# Altium schematic sheet Main.SchDoc
size B; SheetNumber: 1; SheetTotal: 1
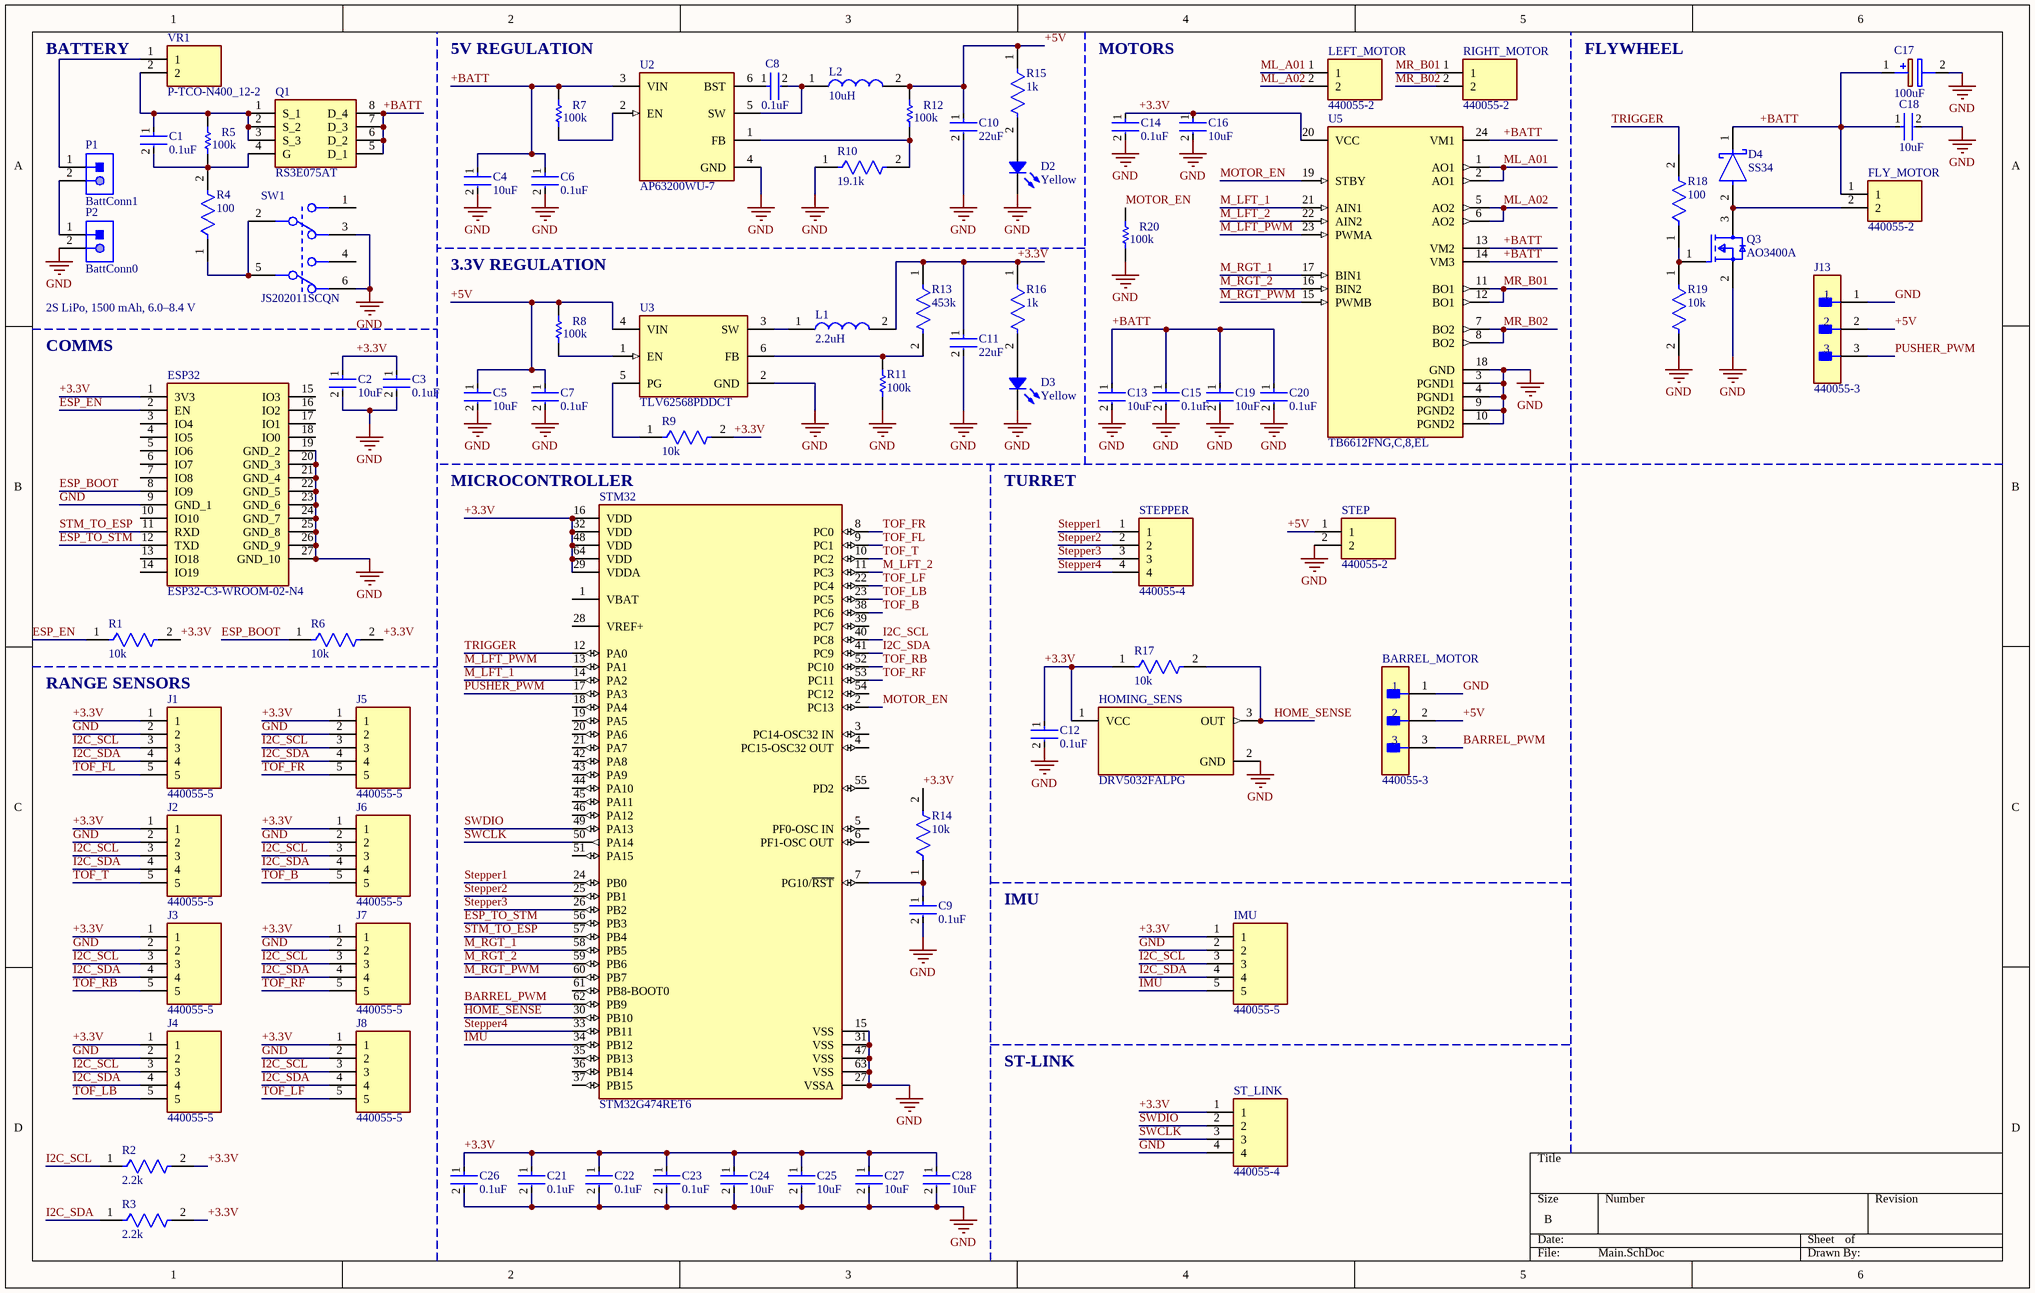
[diagram p0: Main.SchDoc]

## Parts
BARREL_MOTOR  440055-3  [FP-440055-3-MFG]
C1  0.1uF  [FP-C0603C-CF-MFG]
C2  10uF  [FP-GRM188-0_2-IPC_A]
C3  0.1uF  [FP-C0603C-CF-MFG]
C4  10uF  [FP-GRM188-0_2-IPC_A]
C5  10uF  [FP-GRM188-0_2-IPC_A]
C6  0.1uF  [FP-C0603C-CF-MFG]
C7  0.1uF  [FP-C0603C-CF-MFG]
C8  0.1uF  [FP-C0603C-CF-MFG]
C9  0.1uF  [FP-C0603C-CF-MFG]
C10  22uF  [FP-GRM188-0_2-IPC_A]
C11  22uF  [FP-GRM188-0_2-IPC_A]
C12  0.1uF  [FP-C0603C-CF-MFG]
C13  10uF  [FP-GRM188-0_2-IPC_A]
C14  0.1uF  [FP-C0603C-CF-MFG]
C15  0.1uF  [FP-C0603C-CF-MFG]
C16  10uF  [FP-GRM188-0_2-IPC_A]
C17  100uF  [CAPPRD200W55D500H1250]
C18  10uF  [FP-GRM188-0_2-IPC_A]
C19  10uF  [FP-GRM188-0_2-IPC_A]
C20  0.1uF  [FP-C0603C-CF-MFG]
C21  0.1uF  [FP-C0603C-CF-MFG]
C22  0.1uF  [FP-C0603C-CF-MFG]
C23  0.1uF  [FP-C0603C-CF-MFG]
C24  10uF  [FP-GRM188-0_2-IPC_A]
C25  10uF  [FP-GRM188-0_2-IPC_A]
C26  0.1uF  [FP-C0603C-CF-MFG]
C27  10uF  [FP-GRM188-0_2-IPC_A]
C28  10uF  [FP-GRM188-0_2-IPC_A]
D2  Yellow  [LED 1206_3216 YELLOW]
D3  Yellow  [LED 1206_3216 YELLOW]
D4  SS34  [FP-SMC-MFG]
ESP32  ESP32-C3-WROOM-02-N4  [ESP32C3WROOM02N4]
FLY_MOTOR  440055-2  [SHDRRA2W50P0X200_1X2_600X770X525P]
HOMING_SENS  DRV5032FALPG  [FP-LPG0003A-MFG]
IMU  440055-5  [4400555]
J1  440055-5  [4400555]
J2  440055-5  [4400555]
J3  440055-5  [4400555]
J4  440055-5  [4400555]
J5  440055-5  [4400555]
J6  440055-5  [4400555]
J7  440055-5  [4400555]
J8  440055-5  [4400555]
J13  440055-3  [FP-440055-3-MFG]
L1  2.2uH  [VLS2520]
L2  10uH  [VLS3012]
LEFT_MOTOR  440055-2  [SHDRRA2W50P0X200_1X2_600X770X525P]
P1  BattConn1  [JST-S2B-PH-K-S_V]
P2  BattConn0  [JST-S2B-PH-K-S_V]
Q1  RS3E075AT  [SOIC127P600X175-8N]
Q3  AO3400A  [FP-SOT23-MFG]
R1  10k  [FP-AC0603-IPC_A]
R2  2.2k  [FP-RT0603-MFG]
R3  2.2k  [FP-RT0603-MFG]
R4  100  [FP-RT0603-MFG]
R5  100k  [RESC0603(1608)_N]
R6  10k  [FP-AC0603-IPC_A]
R7  100k  [RESC0603(1608)_N]
R8  100k  [RESC0603(1608)_N]
R9  10k  [FP-AC0603-IPC_A]
R10  19.1k  [FP-AC0603-MFG]
R11  100k  [RESC0603(1608)_N]
R12  100k  [RESC0603(1608)_N]
R13  453k  [FP-MCT0603-IPC_B]
R14  10k  [FP-AC0603-IPC_A]
R15  1k  [FP-ERA3A-MFG]
R16  1k  [FP-ERA3A-MFG]
R17  10k  [FP-AC0603-IPC_A]
R18  100  [FP-RT0603-MFG]
R19  10k  [FP-AC0603-IPC_A]
R20  100k  [RESC0603(1608)_N]
RIGHT_MOTOR  440055-2  [SHDRRA2W50P0X200_1X2_600X770X525P]
ST_LINK  440055-4  [SHDRRA4W50P15X200_1X4_1000X770X525P]
STEP  440055-2  [SHDRRA2W50P0X200_1X2_600X770X525P]
STEPPER  440055-4  [SHDRRA4W50P15X200_1X4_1000X770X525P]
STM32  STM32G474RET6  [FP-LQFP64-5W-MFG]
SW1  JS202011SCQN  [FP-JS202011SCQN-MFG]
U2  AP63200WU-7  [FP-TSOT26-MFG]
U3  TLV62568PDDCT  [FP-DDC0006A-MFG]
U5  TB6612FNG,C,8,EL  [FP-SSOP24-P-300-0_65A-IPC_A]
VR1  P-TCO-N400_12-2  [THRMC3216X110N]

## Nets
GND: BARREL_MOTOR.1 C2.2 C3.2 C4.2 C5.2 C6.2 C7.2 C9.2 C10.2 C11.2 C12.2 C13.2 C14.2 C15.2 C16.2 C17.2(-) C18.2 C19.2 C20.2 C21.2 C22.2 C23.2 C24.2 C25.2 C26.2 C27.2 C28.2 D2.2 D3.2 ESP32.9(GND_1) ESP32.19(GND_2) ESP32.20(GND_3) ESP32.21(GND_4) ESP32.22(GND_5) ESP32.23(GND_6) ESP32.24(GND_7) ESP32.25(GND_8) ESP32.26(GND_9) ESP32.27(GND_10) HOMING_SENS.2(GND) IMU.2 J1.2 J2.2 J3.2 J4.2 J5.2 J6.2 J7.2 J8.2 J13.1 P2.2 Q3.2(S) R10.1 R11.1 R19.2 R20.1 ST_LINK.4 STEP.2 STM32.15(VSS) STM32.27(VSSA) STM32.31(VSS) STM32.47(VSS) STM32.63(VSS) SW1.3 SW1.6 U2.4(GND) U3.2(GND) U5.3(PGND1) U5.4(PGND1) U5.9(PGND2) U5.10(PGND2) U5.18(GND)
+3.3V: C2.1 C3.1 C11.1 C12.1 C14.1 C16.1 C21.1 C22.1 C23.1 C24.1 C25.1 C26.1 C27.1 C28.1 ESP32.1(3V3) HOMING_SENS.1(VCC) IMU.1 J1.1 J2.1 J3.1 J4.1 J5.1 J6.1 J7.1 J8.1 L1.2 R1.2 R2.2 R3.2 R6.2 R9.2 R13.1 R14.2 R16.1 R17.1 ST_LINK.1 STM32.16(VDD) STM32.29(VDDA) STM32.32(VDD) STM32.48(VDD) STM32.64(VDD) U5.20(VCC)
+5V: BARREL_MOTOR.2 C5.1 C7.1 C10.1 J13.2 L2.2 R8.2 R12.2 R15.1 STEP.1 U3.4(VIN)
+BATT: C4.1 C6.1 C13.1 C15.1 C17.1(+) C18.1 C19.1 C20.1 D4.1(C) FLY_MOTOR.1 Q1.5(D_1) Q1.6(D_2) Q1.7(D_3) Q1.8(D_4) R7.2 U2.3(VIN) U5.13(VM2) U5.14(VM3) U5.24(VM1)
BARREL_PWM: BARREL_MOTOR.3 STM32.62(PB9)
ESP_BOOT: ESP32.8(IO9) R6.1
ESP_EN: ESP32.2(EN) R1.1
ESP_TO_STM: ESP32.12(TXD) STM32.56(PB3)
HOME_SENSE: HOMING_SENS.3(OUT) R17.2 STM32.30(PB10)
I2C_SCL: IMU.3 J1.3 J2.3 J3.3 J4.3 J5.3 J6.3 J7.3 J8.3 R2.1 STM32.40(PC8)
I2C_SDA: IMU.4 J1.4 J2.4 J3.4 J4.4 J5.4 J6.4 J7.4 J8.4 R3.1 STM32.41(PC9)
IMU: IMU.5 STM32.34(PB12)
M_LFT_1: STM32.14(PA2) U5.21(AIN1)
M_LFT_2: STM32.11(PC3) U5.22(AIN2)
M_LFT_PWM: STM32.13(PA1) U5.23(PWMA)
M_RGT_1: STM32.58(PB5) U5.17(BIN1)
M_RGT_2: STM32.59(PB6) U5.16(BIN2)
M_RGT_PWM: STM32.60(PB7) U5.15(PWMB)
ML_A01: LEFT_MOTOR.1 U5.1(AO1) U5.2(AO1)
ML_A02: LEFT_MOTOR.2 U5.5(AO2) U5.6(AO2)
MOTOR_EN: R20.2 STM32.2(PC13) U5.19(STBY)
MR_B01: RIGHT_MOTOR.1 U5.11(BO1) U5.12(BO1)
MR_B02: RIGHT_MOTOR.2 U5.7(BO2) U5.8(BO2)
PUSHER_PWM: J13.3 STM32.17(PA3)
Stepper1: STEPPER.1 STM32.24(PB0)
Stepper2: STEPPER.2 STM32.25(PB1)
Stepper3: STEPPER.3 STM32.26(PB2)
Stepper4: STEPPER.4 STM32.33(PB11)
STM_TO_ESP: ESP32.11(RXD) STM32.57(PB4)
SWCLK: ST_LINK.3 STM32.50(PA14)
SWDIO: ST_LINK.2 STM32.49(PA13)
TOF_B: J6.5 STM32.38(PC6)
TOF_FL: J1.5 STM32.9(PC1)
TOF_FR: J5.5 STM32.8(PC0)
TOF_LB: J4.5 STM32.23(PC5)
TOF_LF: J8.5 STM32.22(PC4)
TOF_RB: J3.5 STM32.52(PC10)
TOF_RF: J7.5 STM32.53(PC11)
TOF_T: J2.5 STM32.10(PC2)
TRIGGER: R18.2 STM32.12(PA0)
NetC1_1: C1.1 Q1.1(S_1) Q1.2(S_2) Q1.3(S_3) R5.2 VR1.2
NetC1_2: C1.2 Q1.4(G) R4.2 R5.1
NetC8_1: C8.1 U2.6(BST)
NetC8_2: C8.2 L2.1 U2.5(SW)
NetC9_1: C9.1 R14.1 STM32.7(PG10/~{RST})
NetD2_1: D2.1 R15.2
NetD3_1: D3.1 R16.2
NetD4_2: D4.2(A) FLY_MOTOR.2 Q3.3(D)
NetL1_1: L1.1 U3.3(SW)
NetP1_1: P1.1 VR1.1
NetP1_2: P1.2 P2.1
NetQ3_1: Q3.1(G) R18.1 R19.1
NetR4_1: R4.1 SW1.2 SW1.5
NetR7_1: R7.1 U2.2(EN)
NetR8_1: R8.1 U3.1(EN)
NetR9_1: R9.1 U3.5(PG)
NetR10_2: R10.2 R12.1 U2.1(FB)
NetR11_2: R11.2 R13.2 U3.6(FB)

Not connected (* = marked no-connect by the designer): ESP32 3(IO4) 4(IO5) 5(IO6) 6(IO7) 7(IO8) 10(IO10) 13(IO18) 14(IO19) 15(IO3) 16(IO2) 17(IO1) 18(IO0); STM32 1(VBAT) 3(PC14-OSC32_IN) 4(PC15-OSC32_OUT) 5(PF0-OSC_IN) 6(PF1-OSC_OUT) 18(PA4) 19(PA5) 20(PA6) 21(PA7) 28(VREF+) 35(PB13) 36(PB14) 37(PB15) 39(PC7) 42(PA8) 43(PA9) 44(PA10) 45(PA11) 46(PA12) 51(PA15) 54(PC12) 55(PD2) 61(PB8-BOOT0); SW1 1 4

## Notes on the sheet
- BATTERY
- (near R7) 5V REGULATION
- MOTORS
- FLYWHEEL
- Even though the RS3E075AT is efficient, 1.5A still generates some heat.
  Copper Pours: In Altium, use a large Copper Pour (Polygon) for the Drain pins (5, 6, 7, 8). The copper acts as a heatsink to pull heat away from the component.
  Trace Width: Use a Trace Width Calculator. For 1.5A on a standard 1oz copper board, you should aim for at least 35-40 mils (1mm) wide traces for your power path.
- Type @ to refer to a designator
- (near R8) 3.3V REGULATION
- 2S LiPo, 1500 mAh, 6.0–8.4 V
- COMMS
- (near STM32) MICROCONTROLLER
- TURRET
- RANGE SENSORS
- IMU
- ST-LINK

## Library data of the parts
BARREL_MOTOR J13 = CMP-03369-000061-1: CONN HEADER R/A 3POS 2MM; Manufacturer: TE Connectivity; Voltage Rating: 250V; Conn Orientation: Right Angle; Current Rating: 3A; Number Of Contacts: 3; Conn Gender: Male; Height: 5.25mm; Automotive: No; Manufacturer Part Number: 440055-3; Temperature: -25°C to +85°C; Pitch: 2mm; Category: Conn; Device Class L1: Connectors; ComponentLink2Description: Datasheet; Footprint Url: https://www.te.com/commerce/DocumentDelivery/DDEController?Action=showdoc&DocId=Customer+Drawing%7F440055%7FB4%7Fpdf%7FEnglish%7FENG_CD_440055_B4.pdf%7F440055-3; Package: 440055-3; ComponentLink2URL: https://www.te.com/usa-en/product-440055-3.datasheet.pdf; Number Of Rows: 1; Octopart: https://octopart.com/440055-3-te+connectivity-40644627; Mouser Description: Headers & Wire Housings 3 POS HDR R/A 2.0mm; Digikey Description: CONN HEADER R/A 3POS 2MM; Device Class L2: Headers and Wire Housings; Lead Free: Yes; Temperature Range High: +85°C; RoHS: TRUE; Temperature Range Low: -25°C; Contact Material: Tin; Device Class L3: unset
C1 C3 C6-C9 C12 C14 C15 C20-C23 C26 = CMP-2006-03630-2: Manufacturer Part Number: C0603C101F1GACTU; Manufacturer: KEMET; Tolerance: 0.01; Material: Ceramic; Automotive Grade: Grade 1; Capacitance: 100 pF; Voltage Rating: 100 V; Temperature Coefficient: 30ppm/°C; Value: 100 pF; Temperature Characteristic: C0G; Device Class L1: Passive Components; RoHS: TRUE; Height: 0.87mm; Digikey Description: CAP CER 100PF 100V 1% NP0 0603; Device Class L3: Ceramic Capacitors; Temperature: -55°C to +125°C; Package: C0603C-CF; Lead Free: Yes; Category: Cap; Device Class L2: Capacitors; Mouser Description: Multilayer Ceramic Capacitors MLCC - SMD/SMT 100volts 100pF C0G 1%; Temperature Range Low: -55°C; ComponentLink2URL: https://api.kemet.com/component-edge/download/datasheet/C0603C100J5GACAUTO.pdf; Octopart: https://octopart.com/c0603c101f1gactu-kemet-9143865; Automotive: Yes; Temperature Range High: +125°C; ComponentLink2Description: Datasheet
C2 C4 C5 C13 C16 C18 C19 C24 C25 C27 C28 = CMP-2006-02814-2: Chip Multilayer Ceramic Capacitors for General Purpose, 0603, 10uF, X5R, 15%, 20%, 16V; Width: 0.031inch; Case/Package: 0603; Mount: Surface Mount; Capacitance: 10uF; Depth: 0.8mm; REACH SVHC: No SVHC; Lead Free: Lead Free; Tolerance: 20%; Case Code (Imperial): 0603; Voltage Rating: 16V; Height: 0.8mm; Case Code (Metric): 1608; Thickness: 0.031inch; Voltage: 16V; Voltage Rating (DC): 16V; Length: 1.6mm; Max Operating Temperature: 85°C; Dielectric: X5R; Min Operating Temperature: -55°C; Packaging: Tape and Reel; Package Quantity: 4000
C10 C11 = CMP-06035-063651-1: Multilayer Ceramic Capacitor 22uF 20% 16V X5R 0603 Paper T/R
C17 = EEU-FR1C101: Capacitor Polarised; Manufacturer_Name: Panasonic; Datasheet Link: http://industrial.panasonic.com/cdbs/www-data/pdf/RDF0000/ABA0000C1259.pdf; Height: 12.5mm; Manufacturer_Part_Number: EEU-FR1C101; Mouser Part Number: 667-EEU-FR1C101; Mouser Price/Stock: https://www.mouser.co.uk/ProductDetail/Panasonic/EEU-FR1C101?qs=ob%252BdNz2%252BYEhUA1aQKNasqg%3D%3D; Arrow Part Number: EEU-FR1C101; Arrow Price/Stock: https://www.arrow.com/en/products/eeu-fr1c101/panasonic?region=europe
D2 D3 = 25-21UYC/S530-A2/TR8: LED YELLOW CLEAR 2SMD; Manufacturer: Everlight Electronics Co Ltd; Configuration: Standard; Current - Test: 20mA; Lens Color: Colorless; Lens Size: 1.10mm Dia; Lens Style: Round with Domed Top; Millicandela Rating: 45mcd; Viewing Angle: 60°; Voltage - Forward (Vf) (Typ): 2V; Wavelength - Dominant: 589nm; Wavelength - Peak: 591nm; Part Number: 25-21UYC/S530-A2/TR8; Color: Yellow; ComponentLink1Description: Datasheet; ComponentLink1URL: //media.digikey.com/pdf/Data%20Sheets/Everlight%20PDFs/25-21UYC-S530-A2-TR8_V6_11-12-18.pdf; ComponentLink2Description: DigiKey Link; ComponentLink2URL: https://www.digikey.com/en/products/detail/everlight-electronics-co-ltd/25-21UYC-S530-A2-TR8/8535289; Device Package: 1206 (3216 Metric); Height (Max): 1.20mm; LastUpdated: 6/3/2024 8:01:38 PM; Lens Transparency: Clear; Lifecycle Status: Active; Minimum Order: 1; Mounting Type: Surface Mount; Package / Case: 1206 (3216 Metric); Packaging: TapeAndReel; PartId: 2; Part Status: Active; Price: 0.08; Series: -; Size / Dimension: 3.20mm L x 1.60mm W; Supplier 1: DigiKey; Supplier Part Number 1: 1080-1595-1-ND; Supplier Device Package: 2-SMD; Value: Yellow
D4 = CMP-02539-000066-1: DIODE SCHOTTKY 40V 3A DO214AB; Peak Non-Repetitive Surge Current: 100A; Forward Voltage: 500mV; Element Configuration: Single; Max Reverse Current: 500uA; Case/Package: SMC; Radiation Hardening: No; Series: -; Max Surge Current: 100A; RoHS Compliant: Yes; Min Operating Temperature: -55°C; Average Rectified Current: 3A; Max Reverse Leakage Current: 500uA; Package Quantity: 3500; Max Reverse Voltage (DC): 40V; Forward Current: 3A; Packaging: Tape and Reel; Max Operating Temperature: 125°C; Max Repetitive Reverse Voltage (Vrrm): 40V; Number of Pins: 2; Mount: Surface Mount
ESP32 = ESP32-C3-WROOM-02-N4: Integrated Circuit; Manufacturer_Name: Espressif Systems; Datasheet Link: https://www.mouser.ch/datasheet/2/891/Espressif_ESP32_C3_WROOM_02-2006871.pdf; Height: 3.35mm; Manufacturer_Part_Number: ESP32-C3-WROOM-02-N4; Mouser Part Number: 356-ESP32C3WROOM02N4; Mouser Price/Stock: https://www.mouser.co.uk/ProductDetail/Espressif-Systems/ESP32-C3-WROOM-02-N4?qs=stqOd1AaK7%2FqjTZKEOgfUg%3D%3D
FLY_MOTOR LEFT_MOTOR RIGHT_MOTOR STEP = 440055-2: Connector; Manufacturer_Name: TE Connectivity; Datasheet Link: https://www.te.com/commerce/DocumentDelivery/DDEController?Action=srchrtrv&DocNm=1-1773713-2_HPI_QRG_EN&DocType=Data%20Sheet&DocLang=English&PartCntxt=440055-2&DocFormat=pdf; Height: 5.25mm; Manufacturer_Part_Number: 440055-2; Mouser Part Number: 571-440055-2; Mouser Price/Stock: https://www.mouser.co.uk/ProductDetail/TE-Connectivity/440055-2?qs=DE9Qji9blsSmCkgS7fKI6w%3D%3D; Arrow Part Number: 440055-2; Arrow Price/Stock: https://www.arrow.com/en/products/440055-2/te-connectivity?utm_currency=USD&region=nac
HOMING_SENS = CMP-04937-000007-1: LP HALL 32 LPG
IMU J1-J8 = 440055-5: Connector; Manufacturer_Name: TE Connectivity; Datasheet Link: https://www.te.com/commerce/DocumentDelivery/DDEController?Action=srchrtrv&DocNm=1-1773713-2_HPI_QRG_EN&DocType=Data%20Sheet&DocLang=English&PartCntxt=440055-5&DocFormat=pdf; Height: 5.25mm; Manufacturer_Part_Number: 440055-5; Mouser Part Number: 571-440055-5; Mouser Price/Stock: https://www.mouser.co.uk/ProductDetail/TE-Connectivity/440055-5?qs=DE9Qji9blsSCZ1TIZpnBjw%3D%3D; Arrow Part Number: 440055-5; Arrow Price/Stock: https://www.arrow.com/en/products/440055-5/te-connectivity?region=nac
L1 = VLS252010HBX-2R2M-1: Inductor; Manufacturer_Name: TDK; Datasheet Link: https://product.tdk.com/system/files/dam/doc/product/inductor/inductor/smd/catalog/inductor_commercial_power_vls252010hbx-1_en.pdf; Manufacturer_Part_Number: VLS252010HBX-2R2M-1; Mouser Part Number: 810-VLS25201HBX2R2M1; Mouser Price/Stock: https://www.mouser.co.uk/ProductDetail/TDK/VLS252010HBX-2R2M-1?qs=uwKJARvjadMU3dC%2Ft0aiHA%3D%3D; Arrow Part Number: VLS252010HBX-2R2M-1; Arrow Price/Stock: https://www.arrow.com/en/products/vls252010hbx-2r2m-1/tdk?region=europe
L2 = VLS3012CX-100M-1: Inductor; Manufacturer_Name: TDK; Datasheet Link: https://product.tdk.com/system/files/dam/doc/product/inductor/inductor/smd/catalog/inductor_commercial_power_vls3012cx-1_en.pdf; Manufacturer_Part_Number: VLS3012CX-100M-1; Mouser Part Number: 810-VLS3012CX-100M-1; Mouser Price/Stock: https://www.mouser.co.uk/ProductDetail/TDK/VLS3012CX-100M-1?qs=1mbolxNpo8ceNo1aeERl9w%3D%3D; Arrow Part Number: VLS3012CX-100M-1; Arrow Price/Stock: https://www.arrow.com/en/products/vls3012cx-100m-1/tdk?utm_currency=USD&region=europe
P1 P2 = CMP-1755-00004-1: Male Header, Pitch 2 mm, 1 x 2 Position, Height 4.8 mm, Tail Length 3.4 mm, -25 to 85 degC, RoHS, Bulk; Case\Package: Radial; Tolerance: 20%; Capacitance: 10 uF; Voltage Rating (DC): 50 V; Packaging: Bulk; ComponentLink1URL: http://www.jst-mfg.com/product/pdf/eng/ePH.pdf; Radiation Hardening: No; Height: 11 mm; Package Quantity: 200; PackageDescription: Male Header, Pitch 2 mm, 1 x 2 Position, Height 4.8 mm, Tail Length 3.4 mm; PackageReference: S2B-PH-K-S; Diameter: 5 mm; Pins: 2; Mount: Through Hole; Max Operating Temperature: 85 degC; Min Operating Temperature: -40 degC; ComponentLink1Description: Datasheet; DatasheetVersion: Dec-12; Length: 11 mm; Lead Pitch: 2 mm; REACH SVHC: No SVHC; Voltage Rating: 50 V; RoHSCompliant: true
Q1 = RS3E075AT: MOSFET (P-Channel); Manufacturer_Name: ROHM Semiconductor; Datasheet Link: https://fscdn.rohm.com/en/products/databook/datasheet/discrete/transistor/mosfet/rs3e075attb1-e.pdf; Height: 1.75mm; Manufacturer_Part_Number: RS3E075AT; Mouser Part Number: N/A; Mouser Price/Stock: https://www.mouser.co.uk/ProductDetail/ROHM-Semiconductor/RS3E075AT?qs=W0yvOO0ixfG3uBr1%252BCakYg%3D%3D
Q3 = CMP-83955-000006-1: MOSFET N-CH 30V 5.7A SOT23; Input Capacitance: 630pF; Number of Elements: 1; Rds On Max: 26.5mR; Max Power Dissipation: 1.4W; Gate to Source Voltage (Vgs): 12V; Min Operating Temperature: -55°C; Lead Free: Lead Free; Number of Pins: 3; Drain to Source Voltage (Vdss): 30V; Case/Package: SOT-23; Mount: Surface Mount; Continuous Drain Current (ID): 5.7A; Radiation Hardening: No; Packaging: Tape and Reel; Max Operating Temperature: 150°C; Power Dissipation: 1.4W
R1 R6 R9 R14 R17 R19 = CMP-03412-040683-1: RES 10kΩ 5.00% 0.2W 0603
R2 R3 = CMP-03412-006219-1: RT0603 2.2KΩ 0.1W 25 ppm/°C 0.50%; Manufacturer Part Number: RT0603DRD132K2L; Manufacturer: Yageo; Voltage Rating: 75V; Tolerance: 0.005; Octopart: https://octopart.com/rt0603drd132k2l-yageo-91016345; Temperature: -55°C to +155°C; Height: 0.55mm; Ipc Land Pattern Name: RESC16080X45; Power Rating: 0.1W; Temperature Coefficient: 25 ppm/°C; Footprint Url: http://www.yageo.com/exep/pages/download/literatures/PYu-R_Mount_10.pdf; Automotive: No; Device Class L3: Chip SMD Resistors; Package: RT0603; ComponentLink2URL: http://www.yageo.com/documents/recent/PYu-RT_1-to-0.01_RoHS_L_9.pdf; Temperature Range Low: -55°C; RoHS: TRUE; Temperature Range High: +155°C; Value: 2.2KΩ; Composition: Thin Film; ComponentLink2Description: Datasheet; Device Class L2: Resistors; Device Class L1: Passive Components; Series: RT; Resistance: 2.2KΩ; Lead Free: Yes; Category: Res
R4 R18 = CMP-03412-013198-1: RT0603 100Ω 0.1W 50 ppm/°C 1.00%; Manufacturer Part Number: RT0603FRE13100RL; Manufacturer: Yageo; Tolerance: 0.01; Voltage Rating: 75V; Lead Free: Yes; Device Class L1: Passive Components; ComponentLink2Description: Datasheet; Automotive: No; Height: 0.55mm; Footprint Url: http://www.yageo.com/exep/pages/download/literatures/PYu-R_Mount_10.pdf; Value: 100Ω; Resistance: 100Ω; Mouser Description: Thin Film Resistors - SMD 1/10W 100 ohm 1% 50ppm; Composition: Thin Film; Package: RT0603; Device Class L2: Resistors; Temperature Range Low: -55°C; Power Rating: 0.1W; Temperature: -55°C to +155°C; Ipc Land Pattern Name: RESC16080X45; Category: Res; Temperature Coefficient: 50 ppm/°C; Temperature Range High: +155°C; Series: RT; Octopart: https://octopart.com/rt0603fre13100rl-yageo-30512362; RoHS: TRUE; Device Class L3: Chip SMD Resistors; ComponentLink2URL: http://www.yageo.com/documents/recent/PYu-RT_1-to-0.01_RoHS_L_9.pdf
R5 R7 R8 R11 R12 R20 = CMP-1012-00736-1: 100K 0.1W 1% 0603 (1608 Metric)  SMD; Value: 100000.00 Ohm; Case-Metric: 1608; Case-EIA: 0603; Power: 0.1 W; Tolerance: 1 %; Technology: SMT
R10 = CMP-03412-034985-2: RES 19.1KΩ 1.00% 0.1W 0603; Voltage Rating: 50V; Resistance: 19.1kR; Power Rating: 100mW; Temperature Coefficient: 100ppm/°C; Tolerance: 1%; Packaging: Tape and Reel; Features: Moisture Resistant; Case Code (Imperial): 0603; Termination: SMD/SMT; Series: AC; Length: 0.063inch; Height: 0.022inch; Width: 0.8mm; Number of Terminations: 2; Case Code (Metric): 1608; Resistor Type: Thick Film; Max Operating Temperature: 155°C; Min Operating Temperature: -55°C; Case/Package: 0603; Max Power Dissipation: 100mW
R13 = CMP-02407-003985-1: RES SMD 100 OHM 1% 1/8W 0603; Resistance: 453kR; Case/Package: 0603; Packaging: Tape and Reel; Min Operating Temperature: -55°C; Composition: Thin Film; Max Operating Temperature: 125°C; Length: 1.55mm; Tolerance: 1%; Lead Free: Lead Free; Military Standard: Not; Depth: 0.85mm
R15 R16 = CMP-00287-55412082-1: ERA3ARW102V Res Thin Film 0603 1K Ohm 0.05% 0.1W ±10ppm/°C Molded SMD Punched Carrier T/R; Resistance: 1kΩ; Voltage Rating (DC): 75V; Max Power Dissipation: 100mW; Voltage Rating: 150V; Schedule B: 8533210045, 8533210045; Composition: Metal Film, Thin Film; Depth: 800µm; Radiation Hardening: No; RoHS: Compliant; Length: 1.6mm; Width: 787.4µm; Number of Pins: 2; Height: 450µm; Tolerance: 0.05%; Case/Package: 0603; Packaging: Cut Tape; Case Code (Imperial): 0603; Case Code (Metric): 1608; Military Standard: Not; Lifecycle Status: Production; Power Rating: 100mW; Max Operating Temperature: 155°C; Lead Free: Lead Free; Number of Terminations: 2; Mount: Surface Mount; Min Operating Temperature: -55°C; REACH SVHC: No SVHC; Contact Plating: Tin; Temperature Coefficient: 10ppm/°C; NexarPartId: 55412082
ST_LINK STEPPER = 440055-4: Connector; Manufacturer_Name: TE Connectivity; Datasheet Link: https://www.te.com/commerce/DocumentDelivery/DDEController?Action=srchrtrv&DocNm=1-1773713-2_HPI_QRG_EN&DocType=Data%20Sheet&DocLang=English&PartCntxt=440055-4&DocFormat=pdf; Height: 5.25mm; Manufacturer_Part_Number: 440055-4; Mouser Part Number: 571-440055-4; Mouser Price/Stock: https://www.mouser.co.uk/ProductDetail/TE-Connectivity/440055-4?qs=DE9Qji9blsTeqx7CwQ1BPA%3D%3D; Arrow Part Number: 440055-4; Arrow Price/Stock: https://www.arrow.com/en/products/440055-4/te-connectivity?utm_currency=USD&region=nac
STM32 = CMP-12105-000051-1: MAINSTREAM ARM CORTEX-M4 CORE WI; Manufacturer: STMicroelectronics; Ram Size: 128KBytes; Interface: I2C,SPI,UART,USART,CAN,USB,LIN,IrDA,I2S,SMBus,Other; Number Of I2C Channels: 4; Number Of A/D Converters: 5; Number Of Timers/Counters: 14; Number Of I/Os: 52; Max Supply Voltage: 3.6V; Memory Size: 512KBytes; Number Of Adc Channels: 26; Number Of Cores: 1; Min Supply Voltage: 1.71V; Max Junction Temp: +105°C; Standoff Height: 0.05mm; Number Of Uart Channels: 6; Number Of Spi Channels: 3; Frequency: 170MHz; Data Bus Width: 32bits; Memory Type: FLASH; Number Of Pwm Channels: 32; Package: LQFP64-5W; Manufacturer Part Number: STM32G474RET6; Height: 1.6mm; Mouser Description: Microcontroller 32-Bit ARM Cortex-M4 RISC 512KB Flash 1.71V to 3.6V 64-Pin LQFP; Temperature Range High: +105°C; Octopart: https://octopart.com/stm32g474ret6-stmicroelectronics-102308483; Category: IC; Automotive: No; ComponentLink2URL: https://www.st.com/resource/en/datasheet/stm32g474cb.pdf; Temperature Range Low: -40°C; Device Class L1: Integrated Circuits (ICs); Device Class L2: Embedded Processors and Controllers; Core Architecture: ARM Cortex-M4; Ambient Temperature Range Low: -40°C; ComponentLink2Description: Datasheet; Temperature: -40°C to +105°C; Digikey Description: MAINSTREAM ARM CORTEX-M4 CORE WI; Lead Free: Yes; RoHS: TRUE; Ambient Temperature Range High: +85°C; Device Class L3: Microcontrollers; Number Of Usb Channels: 1
SW1 = CMP-2000-05087-3: SWITCH SLIDE DPDT 300MA 6V; Switch Function: On-On; Actuator Type: Standard; Switch Travel: 2mm; Actuator Color: Black; Contact Resistance: 70mR; Electrical Life: 5000Cycles; Actuator Material: Nylon; REACH SVHC: No SVHC; Series: JS; Min Operating Temperature: -20°C; Depth: 7.5mm; Housing Material: Nylon; Voltage Rating (DC): 6V; Max Operating Temperature: 85°C; Contact Current Rating: 300mA; Package Quantity: 1; Contact Plating: Silver; Contact Material: Copper Alloy; Throw Configuration: DPDT; Current Rating: 300mA; Orientation: Vertical; Max Current Rating: 300mA; Max Voltage Rating (DC): 6V; Flammability Rating: UL94 V-2; Length: 9mm; Packaging: Tape and Reel; Mount: Surface Mount; Actuator Length: 2mm; Lead Free: Lead Free; Termination: Gull Wing; Radiation Hardening: No
U2 = CMP-12757-000010-1: IC REG BUCK ADJUSTABLE 2A TSOT26; Manufacturer: Diodes Inc.; Switching Frequency: 500kHz; Max Supply Voltage: 32V; Number Of Outputs: 1; Nominal Supply Current: 22uA; Min Supply Voltage: 3.8V; Output Type: AdjustableProgrammable; Max Junction Temp: +160°C; Standoff Height: 0.01mm; Octopart: https://octopart.com/ap63200wu-7-diodes+inc.-98099548; Height: 1mm; Temperature Range Low: -40°C; Output Current: 2A; ComponentLink2URL: https://www.diodes.com/assets/Datasheets/AP63200-AP63201-AP63203-AP63205.pdf; Switching Topology: Buck; Automotive: No; Device Class L1: Integrated Circuits (ICs); Ipc Land Pattern Name: SOT95P280X100-6; Package: TSOT26; Temperature Range High: +85°C; RoHS: TRUE; Ambient Temperature Range High: +85°C; Device Class L3: Voltage Regulators - Switching; Temperature: -40°C to +85°C; Device Class L2: Power Management ICs; Footprint Url: https://www.diodes.com/assets/Package-Files/TSOT26.pdf; Mouser Description: AP63200 Series 1.2 V 2 A Adjustable Synchronous Buck Converter - TSOT-26; Category: IC; ComponentLink2Description: Datasheet; Digikey Description: IC REG BUCK ADJUSTABLE 2A TSOT26; Lead Free: Yes; Ambient Temperature Range Low: -40°C; Manufacturer Part Number: AP63200WU-7
U3 = CMP-04918-000671-1: IC REG BUCK ADJ 1A TSOT23-6; Min Output Voltage: 600mV; Output Type: Adjustable; Switching Frequency: 1.5MHz; Output Configuration: Positive; Synchronous Rectifier: Yes; Number of Outputs: 1; Max Input Voltage: 5.5V; Min Input Voltage: 2.5V; Max Operating Temperature: 125°C; Packaging: Cut Tape; Min Operating Temperature: -40°C; RoHS Compliant: Yes; Output Current: 1A; Mount: Surface Mount; Case/Package: SOT-23-6; Max Output Voltage: 5.5V
U5 = CMP-2100-03693-4: IC MOTOR DRIVER 2.7V-5.5V 24SSOP; Logic Function: AND GATE; Interface: Parallel; Operating Supply Voltage: 3V; Max Supply Voltage: 5.5V; Output Current: 1A; Min Supply Voltage: 2.7V; Number of Outputs: 2; Packaging: Tape and Reel; Mount: Surface Mount; Number of Pins: 24; Min Operating Temperature: -20°C; Case/Package: SSOP; Series: -; Max Operating Temperature: 85°C; Package Quantity: 1
VR1 = P-TCO-N450_12-2: Variable Resistor; Manufacturer_Name: Bourns; Manufacturer_Part_Number: P-TCO-N450/12-2; Datasheet Link: https://componentsearchengine.com/Datasheets/1/P-TCO-N450_12-2.pdf; Height: 1.1mm; Mouser Part Number: 652-P-TCO-N450/12-2; Mouser Price/Stock: https://www.mouser.co.uk/ProductDetail/Bourns/P-TCO-N450-12-2?qs=gZXFycFWdAMSEVwBHLsViA%3D%3D